# Altium schematic sheet Servo interface.SchDoc
size A4; Organization: Altium Limited; Address1: L3, 12a Rodborough Rd; Address2: Frenchs Forest; Address3: NSW; Address4: Australia 2086
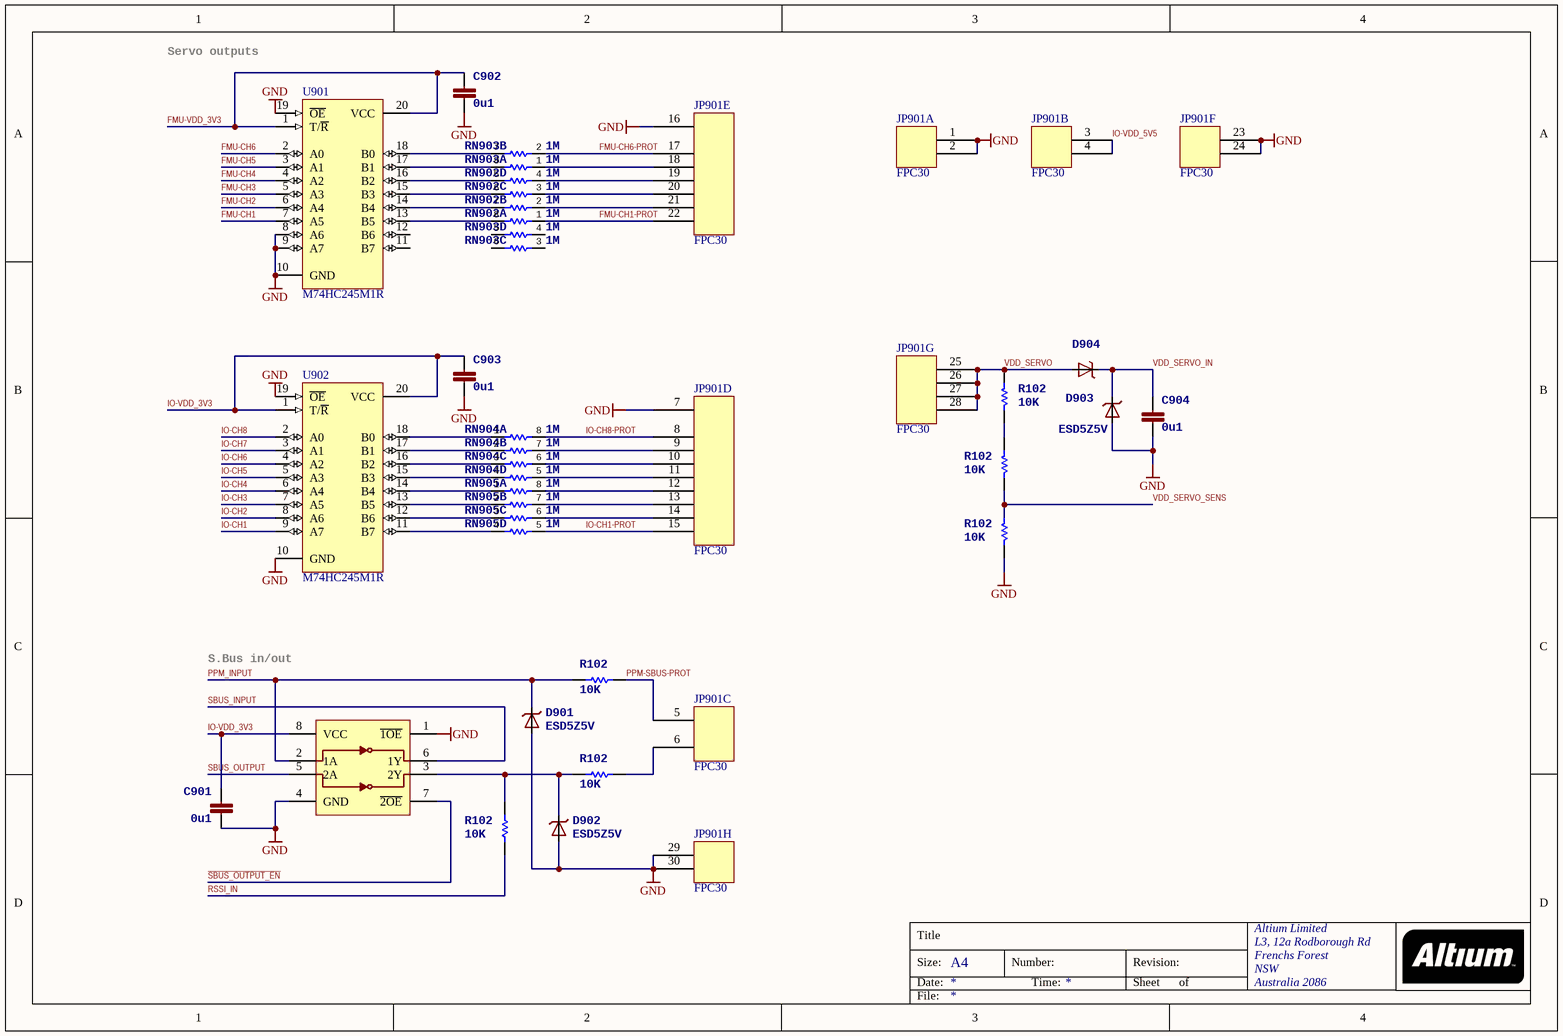
[diagram p0: Servo interface.SchDoc]

## Parts
C901  >NAME: C901  [0603-CAP]  (hidden comment: 0u1)
C902  >NAME: C902  [0603-CAP]  (hidden comment: 0u1)
C903  >NAME: C903  [0603-CAP]  (hidden comment: 0u1)
C904  >NAME: C904  [0603-CAP]  (hidden comment: 0u1)
D901  ESD5Z5V  [SOD523]
D902  ESD5Z5V  [SOD523]
D903  ESD5Z5V  [SOD523]
D904  SS14 SOD323  [SOD323]  (value not drawn)
JP901  FPC30  [FPC-0.5-30下接带锁]  (parts A,B,C,D,E,F,G,H of 8)
R901  >NAME: R102  [0603-RES]  (hidden comment: 10K)
R909  >NAME: R102  [0603-RES]  (hidden comment: 10K)
R910  >NAME: R102  [0603-RES]  (hidden comment: 10K)
R918  >NAME: R102  [0603-RES]  (hidden comment: 10K)
R919  >NAME: R102  [0603-RES]  (hidden comment: 10K)
R922  >NAME: R102  [0603-RES]  (hidden comment: 10K)
RN902  1M  [EXB28V]  (parts A,B,C,D of 4)
RN903  1M  [EXB28V]  (parts A,B,C,D of 4)
RN904  1M  [EXB28V]  (parts A,B,C,D of 4)
RN905  1M  [EXB28V]  (parts A,B,C,D of 4)
U901  M74HC245M1R  [TSSOP20]
U902  M74HC245M1R  [TSSOP20]
U903  74LVC2G240  [TSSOP8_SOT505-2]  (value not drawn)

## Nets
GND: C901.P$2 C902.P$2 C903.P$2 C904.P$2 D901.A D902.A D903.A JP901.1 JP901.2 JP901.7 JP901.16 JP901.23 JP901.24 JP901.29 JP901.30 R919.P$1 U901.8(A6) U901.9(A7) U901.10(GND) U901.19(~{OE}) U902.10(GND) U902.19(~{OE}) U903.1(~{1OE}) U903.4(GND)
FMU-CH1: U901.7(A5)
FMU-CH1-PROT: JP901.22 RN902.1
FMU-CH2: U901.6(A4)
FMU-CH3: U901.5(A3)
FMU-CH4: U901.4(A2)
FMU-CH5: U901.3(A1)
FMU-CH6: U901.2(A0)
FMU-CH6-PROT: JP901.17 RN903.2
FMU-VDD_3V3: C902.P$1 U901.1(T/~{R}) U901.20(VCC)
IO-CH1: U902.9(A7)
IO-CH1-PROT: JP901.15 RN905.5
IO-CH2: U902.8(A6)
IO-CH3: U902.7(A5)
IO-CH4: U902.6(A4)
IO-CH5: U902.5(A3)
IO-CH6: U902.4(A2)
IO-CH7: U902.3(A1)
IO-CH8: U902.2(A0)
IO-CH8-PROT: JP901.8 RN904.8
IO-VDD_3V3: C901.P$1 C903.P$1 U902.1(T/~{R}) U902.20(VCC) U903.8(VCC)
IO-VDD_5V5: JP901.3 JP901.4
PPM-SBUS-PROT: JP901.5 R909.P$2
PPM_INPUT: D901.C R909.P$1 U903.2(1A)
RSSI_IN: R901.P$1
~{SBUS_OUTPUT_EN}: U903.7(~{2OE})
SBUS_INPUT: U903.6(1Y)
SBUS_OUTPUT: U903.5(2A)
VDD_SERVO: D904.A JP901.25 JP901.26 JP901.27 JP901.28 R922.P$2
VDD_SERVO_IN: C904.P$1 D903.C D904.C
VDD_SERVO_SENS: R918.P$1 R919.P$2
NetD902_C: D902.C R901.P$2 R910.P$1 U903.3(2Y)
NetJP901_6: JP901.6 R910.P$2
NetJP901_9: JP901.9 RN904.7
NetJP901_10: JP901.10 RN904.6
NetJP901_11: JP901.11 RN904.5
NetJP901_12: JP901.12 RN905.8
NetJP901_13: JP901.13 RN905.7
NetJP901_14: JP901.14 RN905.6
NetJP901_18: JP901.18 RN903.1
NetJP901_19: JP901.19 RN902.4
NetJP901_20: JP901.20 RN902.3
NetJP901_21: JP901.21 RN902.2
NetR918_P$2: R918.P$2 R922.P$1
NetRN902_5: RN902.5 U901.16(B2)
NetRN902_6: RN902.6 U901.15(B3)
NetRN902_7: RN902.7 U901.14(B4)
NetRN902_8: RN902.8 U901.13(B5)
NetRN903_7: RN903.7 U901.18(B0)
NetRN903_8: RN903.8 U901.17(B1)
NetRN904_1: RN904.1 U902.18(B0)
NetRN904_2: RN904.2 U902.17(B1)
NetRN904_3: RN904.3 U902.16(B2)
NetRN904_4: RN904.4 U902.15(B3)
NetRN905_1: RN905.1 U902.14(B4)
NetRN905_2: RN905.2 U902.13(B5)
NetRN905_3: RN905.3 U902.12(B6)
NetRN905_4: RN905.4 U902.11(B7)

Not connected (* = marked no-connect by the designer): RN903 3(1) 4(1) 5(2) 6(2); U901 11(B7) 12(B6)

## Notes on the sheet
- Servo outputs
- S.Bus in/out
- Title
- Size:
- Date:
- A4
- Number:
- Time:
- Revision:
- Sheet
- of
- File:

## Library data of the parts
C901-C904 = CAP0402: <b>Capacitor</b> / Standard 0603 ceramic capacitor, and 0.1" leaded capacitor.; PARTNO: CC0402ZRY5V7BB104; >VALUE: 0u1
D901-D903 = DIODE-TVS
D904 = DIODE-SCHOTTKY_MSMP: Schottky barrier diode in DO214AC, e.g. Fairchild SS14.
R901 R909 R910 R918 R919 R922 = RESISTOR0402-RES: <b>Resistor</b> / Basic schematic elements and footprints for 0603, 1206, and PTH 1/10th watt (small) resistors.; PARTNO: RC0402FR-0710KL; >VALUE: 10K
RN902-RN905 = 4R-NEXB28V: <b>Array Chip Resistor</b><p> / Source: RS Component / Phycomp; PARTNO: EXB-28V105JX; OC_FARNELL: unknown; OC_NEWARK: unknown
U901 U902 = M74HC245M1R: Octal Bus Transceiver 3-State Non-Inverting; Published: 8-Jun-2000; LatestRevisionDate: 13-Apr-2006; LatestRevisionNote: IPC-7351 Footprint Added.; DatasheetVersion: Oct-1993; PackageVersion: Jul-2001; PackageReference: SO20; Publisher: Altium Limited; PackageDescription: 20-Pin Plastic Small Outline Integrated Circuit 1.27 mm Pitch; Code_JEDEC: MS-013-AC; Code_IPC: SOIC127P1030-20; ComponentLink1Description: Manufacturer Link; ComponentLink1URL: http://www.st.com/; ComponentLink2Description: Datasheet; ComponentLink2URL: http://www.st.com/stonline/products/literature/ds/1930/m74hc245.pdf
U903 = 74LVC2G240-TSSOP-8: Dual inverter tri-state, 3.3V/5V compatible / <br /> / <a href="http://www.nxp.com/documents/data_sheet/74LVC2G240.pdf">http://www.nxp.com/documents/data_sheet/74LVC2G240.pdf</a><br /> / <a href="http://focus.ti.com/lit/ds/symlink/sn74lvc2g240.pdf">http://focus; PARTNO: 74LVC2G240DP,125